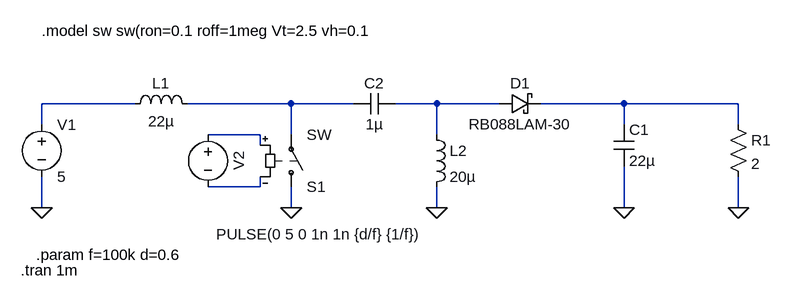
[diagram p0: schematic sepic.asc]
sepic.asc, the LTspice schematic file:
Version 4
SHEET 1 1160 680
WIRE 176 80 32 80
WIRE 416 80 256 80
WIRE 512 80 416 80
WIRE 640 80 576 80
WIRE 736 80 640 80
WIRE 928 80 800 80
WIRE 1104 80 928 80
WIRE 32 112 32 80
WIRE 928 112 928 80
WIRE 1104 112 1104 80
WIRE 368 128 288 128
WIRE 416 128 416 80
WIRE 640 128 640 80
WIRE 368 144 368 128
WIRE 368 208 368 192
WIRE 368 208 288 208
WIRE 32 240 32 192
WIRE 416 240 416 208
WIRE 640 240 640 208
WIRE 928 240 928 176
WIRE 1104 240 1104 192
FLAG 32 240 0
FLAG 928 240 0
FLAG 1104 240 0
FLAG 416 240 0
FLAG 640 240 0
SYMBOL voltage 32 96 R0
WINDOW 123 0 0 Left 0
WINDOW 39 0 0 Left 0
SYMATTR InstName V1
SYMATTR Value 5
SYMBOL sw 416 224 M180
SYMATTR InstName S1
SYMBOL schottky 736 96 R270
WINDOW 0 32 32 VTop 2
WINDOW 3 0 32 VBottom 2
SYMATTR InstName D1
SYMATTR Value RB088LAM-30
SYMATTR Description Diode
SYMATTR Type diode
SYMBOL ind 160 96 R270
WINDOW 0 32 56 VTop 2
WINDOW 3 5 56 VBottom 2
SYMATTR InstName L1
SYMATTR Value 22µ
SYMATTR SpiceLine Rser=0.1
SYMBOL res 1088 96 R0
SYMATTR InstName R1
SYMATTR Value 2
SYMBOL cap 912 112 R0
SYMATTR InstName C1
SYMATTR Value 22µ
SYMATTR SpiceLine Rser=0.02
SYMBOL voltage 288 112 M0
WINDOW 0 -32 56 VBottom 2
WINDOW 3 -171 184 Bottom 2
WINDOW 123 0 0 Left 0
WINDOW 39 0 0 Left 0
SYMATTR InstName V2
SYMATTR Value PULSE(0 5 0 1n 1n {d/f} {1/f})
SYMBOL cap 576 64 R90
WINDOW 0 0 32 VBottom 2
WINDOW 3 32 32 VTop 2
SYMATTR InstName C2
SYMATTR Value 1µ
SYMBOL ind 624 112 R0
SYMATTR InstName L2
SYMATTR Value 20µ
SYMATTR SpiceLine Rser=0.1
TEXT 32 -32 Left 2 !.model sw sw(ron=0.1 roff=1meg Vt=2.5 vh=0.1
TEXT 24 312 Left 2 !.param f=100k d=0.6
TEXT 0 336 Left 2 !.tran 1m

The netlist it stands for:
* sepic.asc
V1 N001 0 5
S1 0 N002 N005 N006 SW
D1 N003 N004 RB088LAM-30
L1 N001 N002 22µ Rser=0.1
R1 N004 0 2
C1 N004 0 22µ Rser=0.02
V2 N005 N006 PULSE(0 5 0 1n 1n {d/f} {1/f})
C2 N003 N002 1µ
L2 N003 0 20µ Rser=0.1
.model D D
.lib standard.dio
.model sw sw(ron=0.1 roff=1meg Vt=2.5 vh=0.1
.param f=100k d=0.6
.tran 1m
.backanno
.end